# Altium schematic sheet Main_Circuit.SchDoc: Main Circuit
size 279 x 215 mm; Date: 4/2/2024; Author: Isaiah Johnston; Revision: 1; SheetNumber: 1; SheetTotal: 1; ParentProject: Drive-It
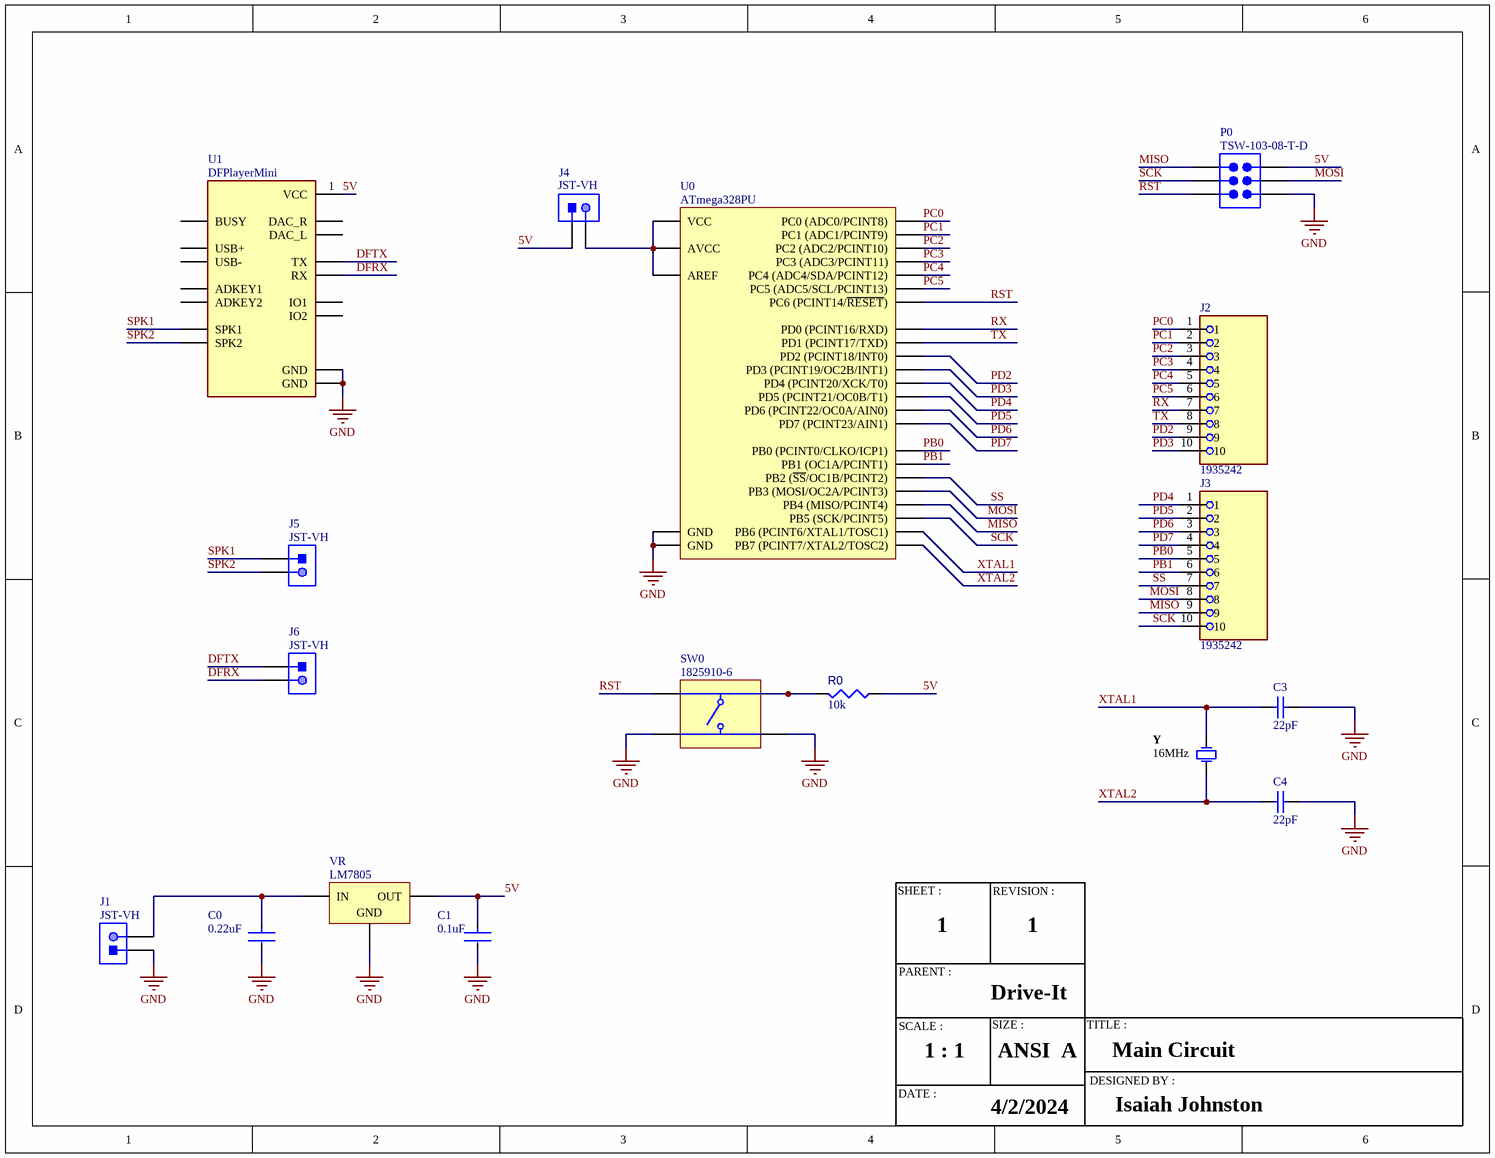
[diagram p0: Main_Circuit.SchDoc]

## Parts
C0  0.22uF  [FP-RCE1K1-2_5-MFG]
C1  0.1uF  [FP-K15H5-MFG]
C3  22pF  [KEMT-C315-THT-2]
C4  22pF  [KEMT-C315-THT-2]
J1  JST-VH  [JST-B2P-VH(LF)(SN)_V]
J2  1935242  [PHOENIX_1935242]
J3  1935242  [PHOENIX_1935242]
J4  JST-VH  [JST-B2P-VH(LF)(SN)_V]
J5  JST-VH  [JST-B2P-VH(LF)(SN)_V]
J6  JST-VH  [JST-B2P-VH(LF)(SN)_V]
P0  TSW-103-08-T-D  [SMTC-TSW-103-08-X-D]
R0  10k  [RESA60-630X240]
SW0  1825910-6  [TECO-1825910-6_V]
U0  ATmega328PU  [ATML-28P3]
U1  DFPlayerMini  [MODULE_DFR0299]
VR  LM7805  [FAIR-TO-220-3]
Y  16MHz  [FOX-FOXSLF160-20]

## Nets
GND: C0.2 C1.2 C3.2 C4.2 J1.1 P0.1 SW0.3 SW0.4 U0.8(GND) U0.22(GND) U1.7(GND) U1.10(GND) VR.2(GND)
5V: C1.1 J4.1 P0.5 R0.1 U1.1(VCC) VR.3(OUT)
DFRX: J6.2 U1.2(RX)
DFTX: J6.1 U1.3(TX)
MISO: J3.9 P0.6 U0.18(PB4_(MISO/PCINT4))
MOSI: J3.8 P0.3 U0.17(PB3_(MOSI/OC2A/PCINT3))
PB0: J3.5 U0.14(PB0_(PCINT0/CLKO/ICP1))
PB1: J3.6 U0.15(PB1_(OC1A/PCINT1))
PC0: J2.1 U0.23(PC0_(ADC0/PCINT8))
PC1: J2.2 U0.24(PC1_(ADC1/PCINT9))
PC2: J2.3 U0.25(PC2_(ADC2/PCINT10))
PC3: J2.4 U0.26(PC3_(ADC3/PCINT11))
PC4: J2.5 U0.27(PC4_(ADC4/SDA/PCINT12))
PC5: J2.6 U0.28(PC5_(ADC5/SCL/PCINT13))
PD2: J2.9 U0.4(PD2_(PCINT18/INT0))
PD3: J2.10 U0.5(PD3_(PCINT19/OC2B/INT1))
PD4: J3.1 U0.6(PD4_(PCINT20/XCK/T0))
PD5: J3.2 U0.11(PD5_(PCINT21/OC0B/T1))
PD6: J3.3 U0.12(PD6_(PCINT22/OC0A/AIN0))
PD7: J3.4 U0.13(PD7_(PCINT23/AIN1))
RST: P0.2 SW0.1 U0.1(PC6_(PCINT14/~{RESET}))
RX: J2.7 U0.2(PD0_(PCINT16/RXD))
SCK: J3.10 P0.4 U0.19(PB5_(SCK/PCINT5))
SPK1: J5.1 U1.6(SPK1)
SPK2: J5.2 U1.8(SPK2)
SS: J3.7 U0.16(PB2_(~{SS}/OC1B/PCINT2))
TX: J2.8 U0.3(PD1_(PCINT17/TXD))
XTAL1: C3.1 U0.9(PB6_(PCINT6/XTAL1/TOSC1)) Y.2
XTAL2: C4.1 U0.10(PB7_(PCINT7/XTAL2/TOSC2)) Y.1
NetC0_1: C0.1 J1.2 VR.1(IN)
NetJ4_2: J4.2 U0.7(VCC) U0.20(AVCC) U0.21(AREF)
NetR0_2: R0.2 SW0.2

Not connected (* = marked no-connect by the designer): U1 4(DAC_R) 5(DAC_L) 9(IO1) 11(IO2) 12(ADKEY1) 13(ADKEY2) 14(USB+) 15(USB-) 16(BUSY)

## Notes on the sheet
- SHEET :
- REVISION :
- PARENT :
- SCALE :
- SIZE :
- TITLE :
- DATE :
- 1 : 1
- ANSI  A
- DESIGNED BY :

## Library data of the parts
C0 = CMP-06035-033138-1: Cap Ceramic Monolithic 220nF 50V 10% Thru-Hole Bulk; Lead Diameter: 0.5mm; Lead/Base Style: Formed Leads; Dielectric: X7R; Ratings: AEC-Q200; Min Operating Temperature: -55°C; Resistor Type: Ceramic; Height - Seated (Max): 0.138inch; Voltage Rating (DC): 50V; Termination: Radial; Max Operating Temperature: 125°C; Tolerance: 10%; Lead Pitch: 0.197inch; Case/Package: Radial; Capacitance: 220nF; Mount: Through Hole; Height: 3.5mm; Packaging: Bulk; Voltage Rating: 50V; Length: 0.157inch; Width: 0.098inch; Package Quantity: 500
C1 = CMP-02417-000048-1: CAP CER 0.1UF 50V X7R RADIAL; Capacitance: 100nF; Tolerance: 10%; Lead/Base Style: Formed Leads; Lead Length: 30mm; Lead Diameter: 0.5mm; Radiation Hardening: No; Lead Pitch: 5mm; Voltage: 50V; Mount: Through Hole; Package Quantity: 5000; Series: K; Case/Package: Dipped; Min Operating Temperature: -55°C; Depth: 2.5mm; Height - Seated (Max): 0.1inch; Voltage Rating (DC): 50V; Packaging: Bulk; RoHS Compliant: Yes; Construction: RADIAL; Thickness: 2.6mm; Max Operating Temperature: 125°C; Voltage Rating: 50V; Diameter: 500um; Dielectric: X7R; Width: 2.5mm; Length: 4mm; Weight: 0.005644oz; Termination: Radial; Height: 4mm
C3 C4 = CMP-1664-00008-1: Capacitor, Ceramic, 22 pF, +/-10 %, 100 V, -55 to 125 degC, 2-Pin THD, RoHS, Bulk; Max Input Voltage: 40 V; Min Input Voltage: 4.2 V; Output Current: 1.5 A; Output Voltage: 1.2 V; Outputs: 1; Case\Package: TO-220; RoHSCompliant: true; Min Operating Temperature: 0 degC; Max Operating Temperature: 125 degC; Package Quantity: 50; ComponentLink2URL: http://capacitoredge.kemet.com/capedge2/DataSheet/Datasheet-C315C220K1G5TA.pdf?pn=C315C220K1G5TA{BULK}; Radiation Hardening: No; Pins: 3; Length: 10.28 mm; ComponentLink1URL: http://www.kemet.com/; ComponentLink2Description: Datasheet; Height: 9.28 mm; REACH SVHC: No SVHC; ComponentLink1Description: Manufacturer URL; Max Ouput Current: 1.5 A; Weight: 0.08113 oz; Packaging: Rail/Tube; DatasheetVersion: Aug-16; Mount: Through Hole; PackageReference: C315-THT-2; Width: 4.82 mm; PackageDescription: 2-Pin Through Hole Device, Body 3.81 x 2.54 mm
J1 J4-J6 = CMP-002-00025-2: Male Header, Pitch 3.96 mm, 1 x 2 Position, Height 10.9 mm, Tail Length 3.7 mm, -25 to 85 degC, RoHS, Bulk; Manufacturer: JST; Case/Package: B2P-VH(LF)(SN); Connector Type: Header; Mounting Technology: TH; Package Reference: B2P-VH(LF)(SN); Package Description: Male Header, Pitch 3.96 mm, 1 x 2 Position, Height 10.9 mm, Tail Length 3.7 mm; Max Operating Temperature: 85°C; Manufacturer URL: http://www.jst.com/home2.html; RoHS Compliant: Unknown; Datasheet Version: May-16; Gender: Male; Min Operating Temperature: -25°C; Datasheet URL: http://www.jst-mfg.com/product/pdf/eng/eVH.pdf
J2 J3 = 1935242: PCB Terminal Screw 5mm 16AWG 400V 17.5A 10 Position COMBICON PT Series | Phoenix Contact 1935242; SnapEDA_Link: https://www.snapeda.com/parts/1935242/Phoenix+Contact/view-part/?ref=snap; Package: None; Value: *; MF: Phoenix Contact; MP: 1935242; Check_prices: https://www.snapeda.com/parts/1935242/Phoenix+Contact/view-part/?ref=eda
P0 = CMP-1024-00335-1: 0.025" SQ Post Header, Through-hole, Vertical, -55 to 105 degC, 2.54 mm Pitch, 6-Pin, Male, RoHS; Manufacturer: Samtec; Pitch: 2.54 mm; PackageDescription: .025[0.64] SQ. Post Terminal Strip Assembly; DatasheetVersion: F-214; ComponentLink3Description: Package Specification; Mounting Technology: Through-hole; ComponentLink1URL: http://www.samtec.com; ComponentLink2URL: http://www.samtec.com/documents/webfiles/pdf/TSW_TH.PDF; PartNumber: TSW-103-08-T-D; ComponentLink1Description: Manufacturer URL; Temperature Range: -55 to 105 degC; ComponentLink2Description: Datasheet; PackageVersion: DM, 8/1988; RoHS: True; ComponentLink3URL: http://www.samtec.com/documents/webfiles/cpdf/TSW-XXX-XX-XXX-X-XX-XXX-MKT.pdf; Orientation: Vertical; PackageReference: TSW-103-08-X-D
R0 = CMP-009-00047-4: Axial Resistor, 10 KOhm, +/- 1%, 0.25 W, -55 to 155 degC, 2-Pin THD, RoHS, Bulk; Manufacturer: Yageo; Power: 250mW; Voltage Rating: 250V; Manufacturer URL: http://www.yageo.com/; Datasheet URL: http://www.yageo.com/documents/recent/Yageo%20LR_MFR_2013.pdf; Value: 10k; Package Reference: MFR-25; Min Operating Temperature: -55°C; Mounting Technology: TH; Package Quantity: 200; Case/Package: Axial; Tolerance: 1%; RoHS Compliant: True; Datasheet Version: Apr-13; Packaging: Bulk; Max Operating Temperature: 155°C; Package Description: 2-Pin Axial Lead, Dia 2.4 mm, Body Length 6.3 mm
SW0 = CMP-1684-00021-1: Tact Switch, SPST-NO, 0.05 A, -35 to 85 degC, 4-Pin THD, RoHS, Bulk; Manufacturer: TE Connectivity; Maximum Contact Resistance: 100mOhm; Mechanical Life: 100000Cycles; Bushing Type: Unthreaded; Switch Configuration: OFF(ON); Maximum DC Voltage Rating: 24V; Contact Rating @ Voltage: 0.05A@24VDC; Actuator Color: Black; Body Orientation: Straight; Function: MomentaryContact; Illumination: N/R; Actuator Style: RoundButton; Actuator Material: PolybutyleneTerephthalate; Dielectric Strength: 500VAC; Pole Throw Configuration: SPST; Actuator Length: 1.4mm; Product Weight: N/A; Contact Material: CopperAlloy; Housing Material: N/A; Terminal Type: PCPins; Minimum Insulation Resistance: 100MOhm; Package Description: 4-Pin Through Hole Device, Body 5.99 x 5.99 mm, Pitch 6.5 mm; Part No: 1825910-6; Package Reference: THD; Base Material: N/A; Manufacturer URL: http://www.te.com; Contact Plating: Silver; RoHS: Yes; Datasheet Version: Rev. C9; Electrical Life: 100000Cycles; Maximum AC Voltage Rating: N/A; Thread Size: N/R; Operating Temperature: -35to85C; Mounting: ThroughHole; Dimension: 5.99x5mm; Datasheet URL: http://www.te.com/commerce/DocumentDelivery/DDEController?Action=showdoc&DocId=Customer+Drawing%7F1825910%7FC9%7Fpdf%7FEnglish%7FENG_CD_1825910_C9.pdf%7F1825910-6; Family: 1825910; Seal Location: N/A; Seal Description: N/A; Packaging: N/A
U0 = CMP-020-00004-3: 8-Bit Microcontroller with 32 KBytes In-System Programmable Flash, 23 I/Os, -40 to 85 degC, 28-Pin PDIP (28P3), RoHS, Tube; Manufacturer: Atmel; I/Os: 23; Density: 32KB; Package Version: Rev. B, 09/2001; Max Clock Frequency: 20MHz; Interface: USART; Max Supply Voltage: 5.5V; Min Supply Voltage: 1.8V; Ethernet Channels: 0; RAM Size: 2KB; RoHS Compliant: True; Datasheet URL: http://www.atmel.com/images/Atmel-8271-8-bit-AVR-Microcontroller-ATmega48A-48PA-88A-88PA-168A-168PA-328-328P_datasheet_Complete.pdf; Packaging: Rail/Tube; Manufacturer URL: http://www.atmel.com/; Mounting Technology: TH; Package URL: http://www.atmel.com/images/Atmel-8271-8-bit-AVR-Microcontroller-ATmega48A-48PA-88A-88PA-168A-168PA-328-328P_datasheet_Complete.pdf; Datasheet Version: Rev. 8271J, 11/2015; Package Description: 28-Pin Plastic Dual Inline Package, Body 34.671 x 7.3025 mm, Pitch 2.54 mm; Package Quantity: 14; Min Operating Temperature: -40°C; Max Operating Temperature: 85°C; Case/Package: DIP; Pins: 28; Package Reference: 28P3
U1 = DFR0299: Dfplayer - a Mini Mp3 Player; Package: None; Price: None; Value: *; MP: DFR0299; Availability: Unavailable
VR = CMP-2000-04938-1: Positive Voltage Regulator, 5 V, 1 A, -40 to 125 degC, 3-Pin TO-220, RoHS, Tube; Manufacturer: FairchildSemiconductor; Maximum Input Voltage: 35V; Maximum Quiescent Current: 8mA; Load Regulation: 100mV; Maximum Output Current: 2.2(Typ)A; Output Type: Fixed; Typical Dropout Voltage @ Current: 2@1AV; Rad Hard: No; Output Voltage: 5V; Accuracy: ±4%; Number of Outputs: 1; Category: LinearRegulator; Package Description: 3-Pin Through Hole Device, Body 10 x 4.5 mm, Pitch 2.54 mm; Packaging: Rail/Tube; Mounting: ThroughHole; Polarity: Positive; Manufacturer URL: https://www.fairchildsemi.com/; Line Regulation: 100mV; Datasheet Version: Aug-12; Datasheet URL: https://datasheet.ciiva.com/26904/lm7805ct-26904988.pdf; Package Reference: TO-220; Package URL: https://www.fairchildsemi.com/package-drawings/TO/TO220B03.pdf; Package: 3TO-220AB; Operating Temperature: -40to125degC; Type: Linear
Y = CMP-1749-00003-1: Resistance Weld Thru-Hole Crystal, 16 MHz, -20 to 70 degC, 2-Pin THD, RoHS, Bulk; Voltage Rating: 250 V; Tolerance: 1%; Resistance: 221 kohm; Case\Package: Axial; Power Rating: 250 mW; RoHSCompliant: true; Package Quantity: 200; Packaging: Bulk; Min Operating Temperature: -55 degC; DatasheetVersion: Mar-15; ComponentLink1URL: http://www.foxonline.com/; Max Operating Temperature: 155 degC; PackageReference: FOXSLF160-20; Mount: Through Hole; PackageDescription: 2-Pin Through Hole Device, Body 11.35 x 4.65 mm; ComponentLink1Description: Manufacturer URL; ComponentLink2URL: http://www.foxonline.com/pdfs/hc49slf.pdf; ComponentLink2Description: Datasheet; Length: 0.248 inch